# EAGLE design teensyShield1.6_alt (EAGLE 7.7.0)
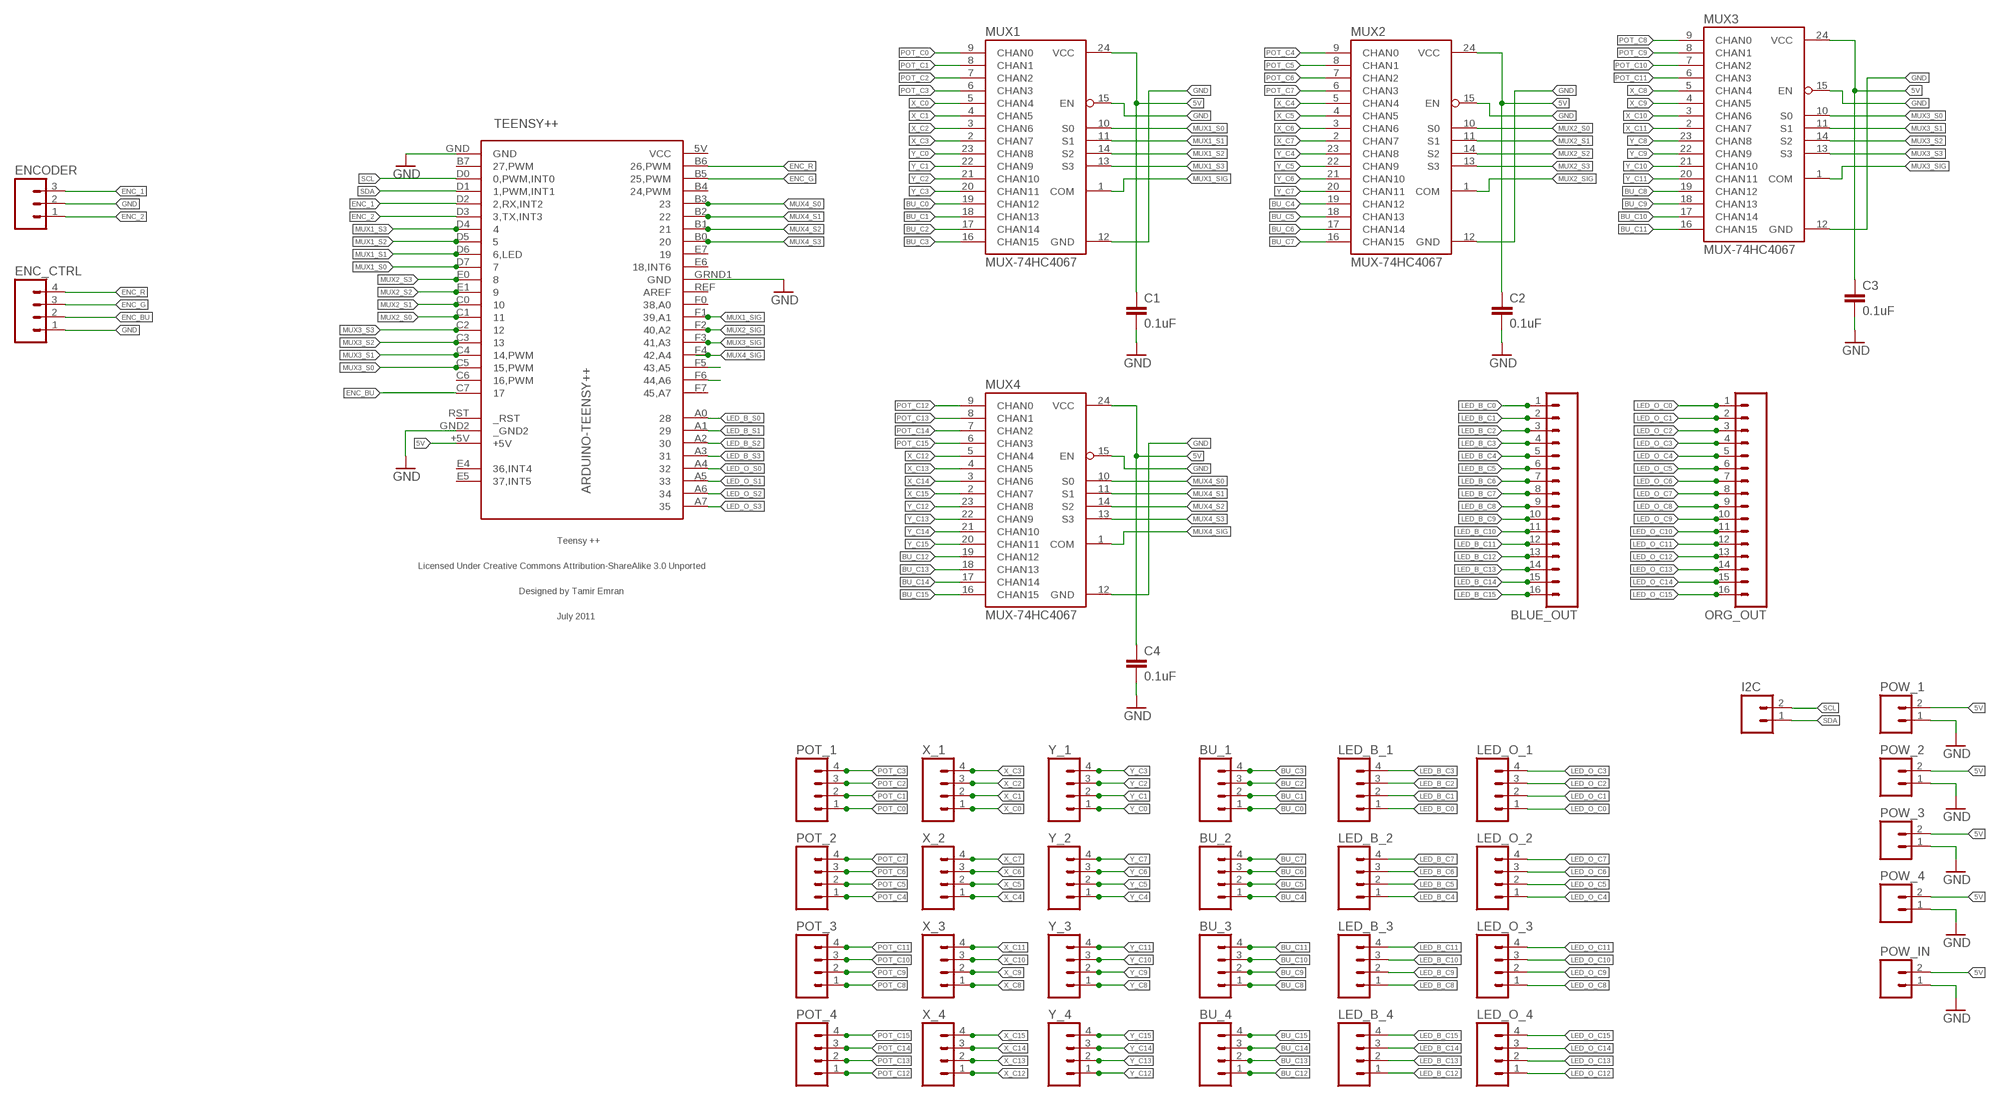
[diagram p0: schematic, sheet 1]

## Parts
BLUE_OUT  M161X16_NO_SILK  [1X16_NO_SILK]
BU_1  M04NO_SILK_ALL_ROUND  [1X04_NO_SILK_ALL_ROUND]
BU_2  M04NO_SILK_ALL_ROUND  [1X04_NO_SILK_ALL_ROUND]
BU_3  M04NO_SILK_ALL_ROUND  [1X04_NO_SILK_ALL_ROUND]
BU_4  M04NO_SILK_ALL_ROUND  [1X04_NO_SILK_ALL_ROUND]
C1  0.1uF  CAP0603  [0603]
C2  0.1uF  CAP0603  [0603]
C3  0.1uF  CAP0603  [0603]
C4  0.1uF  CAP0603  [0603]
ENC_CTRL  M041X04_NO_SILK  [1X04_NO_SILK]
ENCODER  M031X03_NO_SILK  [1X03_NO_SILK]
I2C  M02LOCK  [1X02_LOCK]
LED_B_1  M04NO_SILK_ALL_ROUND  [1X04_NO_SILK_ALL_ROUND]
LED_B_2  M04NO_SILK_ALL_ROUND  [1X04_NO_SILK_ALL_ROUND]
LED_B_3  M04NO_SILK_ALL_ROUND  [1X04_NO_SILK_ALL_ROUND]
LED_B_4  M04NO_SILK_ALL_ROUND  [1X04_NO_SILK_ALL_ROUND]
LED_O_1  M04NO_SILK_ALL_ROUND  [1X04_NO_SILK_ALL_ROUND]
LED_O_2  M04NO_SILK_ALL_ROUND  [1X04_NO_SILK_ALL_ROUND]
LED_O_3  M04NO_SILK_ALL_ROUND  [1X04_NO_SILK_ALL_ROUND]
LED_O_4  M04NO_SILK_ALL_ROUND  [1X04_NO_SILK_ALL_ROUND]
MUX1  MUX-74HC4067  MUX-74HC4067SMD  [SSOP24]
MUX2  MUX-74HC4067  MUX-74HC4067SMD  [SSOP24]
MUX3  MUX-74HC4067  MUX-74HC4067SMD  [SSOP24]
MUX4  MUX-74HC4067  MUX-74HC4067SMD  [SSOP24]
ORG_OUT  M161X16_NO_SILK  [1X16_NO_SILK]
POT_1  M04NO_SILK_ALL_ROUND  [1X04_NO_SILK_ALL_ROUND]
POT_2  M04NO_SILK_ALL_ROUND  [1X04_NO_SILK_ALL_ROUND]
POT_3  M04NO_SILK_ALL_ROUND  [1X04_NO_SILK_ALL_ROUND]
POT_4  M04NO_SILK_ALL_ROUND  [1X04_NO_SILK_ALL_ROUND]
POW_1  M02POLAR  [MOLEX-1X2]
POW_2  M02POLAR  [MOLEX-1X2]
POW_3  M02POLAR  [MOLEX-1X2]
POW_4  M02POLAR  [MOLEX-1X2]
POW_IN  M02POLAR  [MOLEX-1X2]
TEENSY++  ARDUINO-TEENSY++  [TEENSY++]
X_1  M04NO_SILK_ALL_ROUND  [1X04_NO_SILK_ALL_ROUND]
X_2  M04NO_SILK_ALL_ROUND  [1X04_NO_SILK_ALL_ROUND]
X_3  M04NO_SILK_ALL_ROUND  [1X04_NO_SILK_ALL_ROUND]
X_4  M04NO_SILK_ALL_ROUND  [1X04_NO_SILK_ALL_ROUND]
Y_1  M04NO_SILK_ALL_ROUND  [1X04_NO_SILK_ALL_ROUND]
Y_2  M04NO_SILK_ALL_ROUND  [1X04_NO_SILK_ALL_ROUND]
Y_3  M04NO_SILK_ALL_ROUND  [1X04_NO_SILK_ALL_ROUND]
Y_4  M04NO_SILK_ALL_ROUND  [1X04_NO_SILK_ALL_ROUND]

## Nets
5V: C1.1 C2.1 C3.1 C4.1 MUX1.24(VCC) MUX2.24(VCC) MUX3.24(VCC) MUX4.24(VCC) POW_1.2 POW_2.2 POW_3.2 POW_4.2 POW_IN.2
BU_C0: BU_1.1 MUX1.19(CHAN12)
BU_C1: BU_1.2 MUX1.18(CHAN13)
BU_C2: BU_1.3 MUX1.17(CHAN14)
BU_C3: BU_1.4 MUX1.16(CHAN15)
BU_C4: BU_2.1 MUX2.19(CHAN12)
BU_C5: BU_2.2 MUX2.18(CHAN13)
BU_C6: BU_2.3 MUX2.17(CHAN14)
BU_C7: BU_2.4 MUX2.16(CHAN15)
BU_C8: BU_3.1 MUX3.19(CHAN12)
BU_C9: BU_3.2 MUX3.18(CHAN13)
BU_C10: BU_3.3 MUX3.17(CHAN14)
BU_C11: BU_3.4 MUX3.16(CHAN15)
BU_C12: BU_4.1 MUX4.19(CHAN12)
BU_C13: BU_4.2 MUX4.18(CHAN13)
BU_C14: BU_4.3 MUX4.17(CHAN14)
BU_C15: BU_4.4 MUX4.16(CHAN15)
ENC_1: ENCODER.3 TEENSY++.D2(2,RX,INT2)
ENC_2: ENCODER.1 TEENSY++.D3(3,TX,INT3)
ENC_BU: ENC_CTRL.2 TEENSY++.C7
ENC_G: ENC_CTRL.3 TEENSY++.B5(25,PWM)
ENC_R: ENC_CTRL.4 TEENSY++.B6(26,PWM)
GND: C1.2 C2.2 C3.2 C4.2 ENC_CTRL.1 ENCODER.2 MUX1.12(GND) MUX1.15(EN) MUX2.12(GND) MUX2.15(EN) MUX3.12(GND) MUX3.15(EN) MUX4.12(GND) MUX4.15(EN) POW_1.1 POW_2.1 POW_3.1 POW_4.1 POW_IN.1 TEENSY++.GND TEENSY++.GND2(_GND2) TEENSY++.GRND1(GND)
LED_B_C0: BLUE_OUT.1 LED_B_1.1
LED_B_C1: BLUE_OUT.2 LED_B_1.2
LED_B_C2: BLUE_OUT.3 LED_B_1.3
LED_B_C3: BLUE_OUT.4 LED_B_1.4
LED_B_C4: BLUE_OUT.5 LED_B_2.1
LED_B_C5: BLUE_OUT.6 LED_B_2.2
LED_B_C6: BLUE_OUT.7 LED_B_2.3
LED_B_C7: BLUE_OUT.8 LED_B_2.4
LED_B_C8: BLUE_OUT.9 LED_B_3.1
LED_B_C9: BLUE_OUT.10 LED_B_3.2
LED_B_C10: BLUE_OUT.11 LED_B_3.3
LED_B_C11: BLUE_OUT.12 LED_B_3.4
LED_B_C12: BLUE_OUT.13 LED_B_4.1
LED_B_C13: BLUE_OUT.14 LED_B_4.2
LED_B_C14: BLUE_OUT.15 LED_B_4.3
LED_B_C15: BLUE_OUT.16 LED_B_4.4
LED_B_S0: TEENSY++.A0
LED_B_S1: TEENSY++.A1
LED_B_S2: TEENSY++.A2
LED_B_S3: TEENSY++.A3
LED_O_C0: LED_O_1.1 ORG_OUT.1
LED_O_C1: LED_O_1.2 ORG_OUT.2
LED_O_C2: LED_O_1.3 ORG_OUT.3
LED_O_C3: LED_O_1.4 ORG_OUT.4
LED_O_C4: LED_O_2.1 ORG_OUT.5
LED_O_C5: LED_O_2.2 ORG_OUT.6
LED_O_C6: LED_O_2.3 ORG_OUT.7
LED_O_C7: LED_O_2.4 ORG_OUT.8
LED_O_C8: LED_O_3.1 ORG_OUT.9
LED_O_C9: LED_O_3.2 ORG_OUT.10
LED_O_C10: LED_O_3.3 ORG_OUT.11
LED_O_C11: LED_O_3.4 ORG_OUT.12
LED_O_C12: LED_O_4.1 ORG_OUT.13
LED_O_C13: LED_O_4.2 ORG_OUT.14
LED_O_C14: LED_O_4.3 ORG_OUT.15
LED_O_C15: LED_O_4.4 ORG_OUT.16
LED_O_S0: TEENSY++.A4
LED_O_S1: TEENSY++.A5
LED_O_S2: TEENSY++.A6
LED_O_S3: TEENSY++.A7
MUX1_S0: MUX1.10(S0) TEENSY++.D7
MUX1_S1: MUX1.11(S1) TEENSY++.D6(6,LED)
MUX1_S2: MUX1.14(S2) TEENSY++.D5
MUX1_S3: MUX1.13(S3) TEENSY++.D4
MUX1_SIG: MUX1.1(COM)
MUX2_S0: MUX2.10(S0) TEENSY++.C1
MUX2_S1: MUX2.11(S1) TEENSY++.C0
MUX2_S2: MUX2.14(S2) TEENSY++.E1
MUX2_S3: MUX2.13(S3) TEENSY++.E0
MUX2_SIG: MUX2.1(COM)
MUX3_S0: MUX3.10(S0) TEENSY++.C5(15,PWM)
MUX3_S1: MUX3.11(S1) TEENSY++.C4(14,PWM)
MUX3_S2: MUX3.14(S2) TEENSY++.C3
MUX3_S3: MUX3.13(S3) TEENSY++.C2
MUX3_SIG: MUX3.1(COM) TEENSY++.F3(41,A3)
MUX4_S0: MUX4.10(S0) TEENSY++.B3
MUX4_S1: MUX4.11(S1) TEENSY++.B2
MUX4_S2: MUX4.14(S2) TEENSY++.B1
MUX4_S3: MUX4.13(S3) TEENSY++.B0
MUX4_SIG: MUX4.1(COM) TEENSY++.F4(42,A4)
N$1: TEENSY++.F2(40,A2)
N$2: TEENSY++.F1(39,A1)
N$3: TEENSY++.F5(43,A5)
N$4: TEENSY++.+5V
N$5: TEENSY++.F6(44,A6)
POT_C0: MUX1.9(CHAN0) POT_1.1
POT_C1: MUX1.8(CHAN1) POT_1.2
POT_C2: MUX1.7(CHAN2) POT_1.3
POT_C3: MUX1.6(CHAN3) POT_1.4
POT_C4: MUX2.9(CHAN0) POT_2.1
POT_C5: MUX2.8(CHAN1) POT_2.2
POT_C6: MUX2.7(CHAN2) POT_2.3
POT_C7: MUX2.6(CHAN3) POT_2.4
POT_C8: MUX3.9(CHAN0) POT_3.1
POT_C9: MUX3.8(CHAN1) POT_3.2
POT_C10: MUX3.7(CHAN2) POT_3.3
POT_C11: MUX3.6(CHAN3) POT_3.4
POT_C12: MUX4.9(CHAN0) POT_4.1
POT_C13: MUX4.8(CHAN1) POT_4.2
POT_C14: MUX4.7(CHAN2) POT_4.3
POT_C15: MUX4.6(CHAN3) POT_4.4
SCL: I2C.2 TEENSY++.D0(0,PWM,INT0)
SDA: I2C.1 TEENSY++.D1(1,PWM,INT1)
X_C0: MUX1.5(CHAN4) X_1.1
X_C1: MUX1.4(CHAN5) X_1.2
X_C2: MUX1.3(CHAN6) X_1.3
X_C3: MUX1.2(CHAN7) X_1.4
X_C4: MUX2.5(CHAN4) X_2.1
X_C5: MUX2.4(CHAN5) X_2.2
X_C6: MUX2.3(CHAN6) X_2.3
X_C7: MUX2.2(CHAN7) X_2.4
X_C8: MUX3.5(CHAN4) X_3.1
X_C9: MUX3.4(CHAN5) X_3.2
X_C10: MUX3.3(CHAN6) X_3.3
X_C11: MUX3.2(CHAN7) X_3.4
X_C12: MUX4.5(CHAN4) X_4.1
X_C13: MUX4.4(CHAN5) X_4.2
X_C14: MUX4.3(CHAN6) X_4.3
X_C15: MUX4.2(CHAN7) X_4.4
Y_C0: MUX1.23(CHAN8) Y_1.1
Y_C1: MUX1.22(CHAN9) Y_1.2
Y_C2: MUX1.21(CHAN10) Y_1.3
Y_C3: MUX1.20(CHAN11) Y_1.4
Y_C4: MUX2.23(CHAN8) Y_2.1
Y_C5: MUX2.22(CHAN9) Y_2.2
Y_C6: MUX2.21(CHAN10) Y_2.3
Y_C7: MUX2.20(CHAN11) Y_2.4
Y_C8: MUX3.23(CHAN8) Y_3.1
Y_C9: MUX3.22(CHAN9) Y_3.2
Y_C10: MUX3.21(CHAN10) Y_3.3
Y_C11: MUX3.20(CHAN11) Y_3.4
Y_C12: MUX4.23(CHAN8) Y_4.1
Y_C13: MUX4.22(CHAN9) Y_4.2
Y_C14: MUX4.21(CHAN10) Y_4.3
Y_C15: MUX4.20(CHAN11) Y_4.4
Unconnected: TEENSY++.B4(24,PWM) TEENSY++.B7(27,PWM) TEENSY++.C6(16,PWM) TEENSY++.E4(36,INT4) TEENSY++.E5(37,INT5) TEENSY++.E6(18,INT6) TEENSY++.E7 TEENSY++.F0(38,A0) TEENSY++.F7(45,A7) TEENSY++.REF(AREF) TEENSY++.RST(_RST)

## Power pins joined to a net without a drawn wire
VCC: TEENSY++.5V(VCC)

## Library data of the parts
BLUE_OUT ORG_OUT = SparkFun-Connectors:M16: 1x16 .1" header
BU_1-BU_4 ENC_CTRL LED_B_1-LED_B_4 LED_O_1-LED_O_4 POT_1-POT_4 X_1-X_4 Y_1-Y_4 = SparkFun-Connectors:M04: Header 4 Standard 4-pin 0.1" header. Use with straight break away headers (SKU : PRT-00116), right angle break away headers (PRT-00553), swiss pins (PRT-00743), machine pins (PRT-00117), and female headers (PRT-00115). Molex polarized connector foot print use with SKU : PRT-08231 with associated crimp pins and housings. 1MM SMD Version SKU: PRT-10208; PROD_ID: CONN-09696
C1-C4 = SparkFun:CAP: Capacitor Standard 0603 ceramic capacitor, and 0.1" leaded capacitor.
ENCODER = SparkFun-Connectors:M03: Header 3 Standard 3-pin 0.1" header. Use with straight break away headers (SKU : PRT-00116), right angle break away headers (PRT-00553), swiss pins (PRT-00743), machine pins (PRT-00117), and female headers (PRT-00115). Molex polarized connector foot print use with SKU : PRT-08232 with associated crimp pins and housings.
I2C POW_1-POW_4 POW_IN = SparkFun-Connectors:M02: Standard 2-pin 0.1" header. Use with - straight break away headers ( PRT-00116) - right angle break away headers (PRT-00553) - swiss pins (PRT-00743) - machine pins (PRT-00117) - female headers (PRT-00115) Molex polarized connector foot print use with: PRT-08233 with associated crimp pins and housings. 2.54_SCREWTERM for use with PRT-10571. 3.5mm Screw Terminal footprints for PRT-08084 5mm Screw Terminal footprints for use with PRT-08432
MUX1-MUX4 = SparkFun:MUX-74HC4067
TEENSY++ = teensypp:ARDUINO-TEENSY++: Teensy ++ Original Design by Mark Gross Modified Design by Tamir Emran Licensed Under Creative Commons Attribution-ShareAlike 3.0 Unported (CC BY-SA 3.0)

## Board
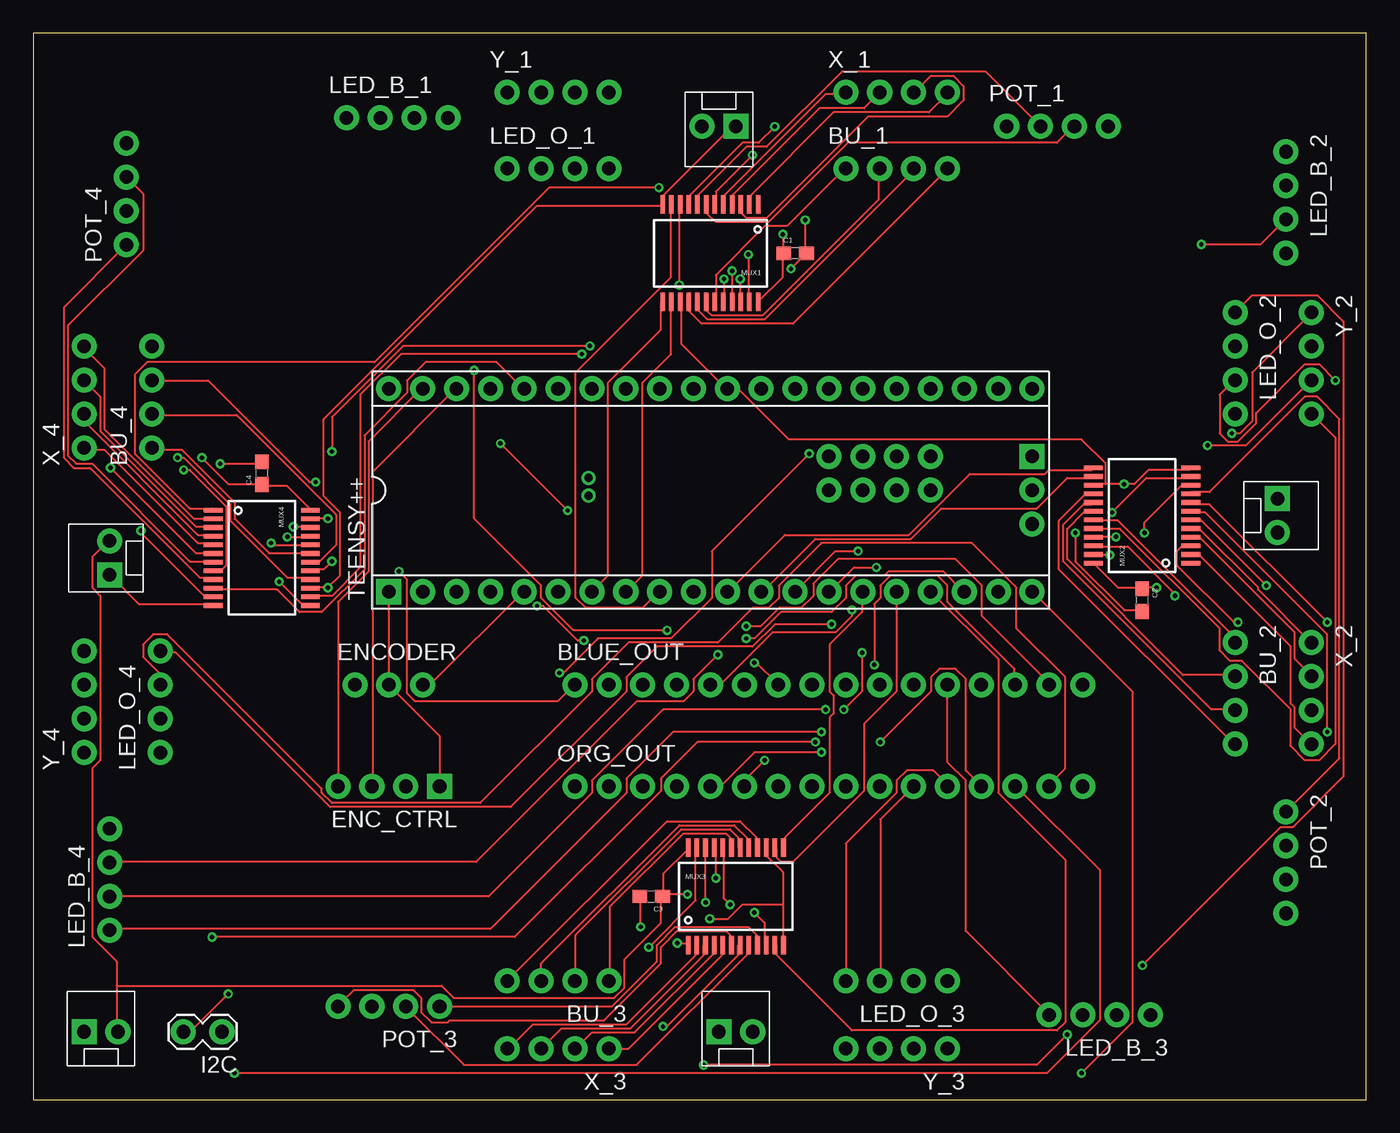
[diagram p1: board, top side]
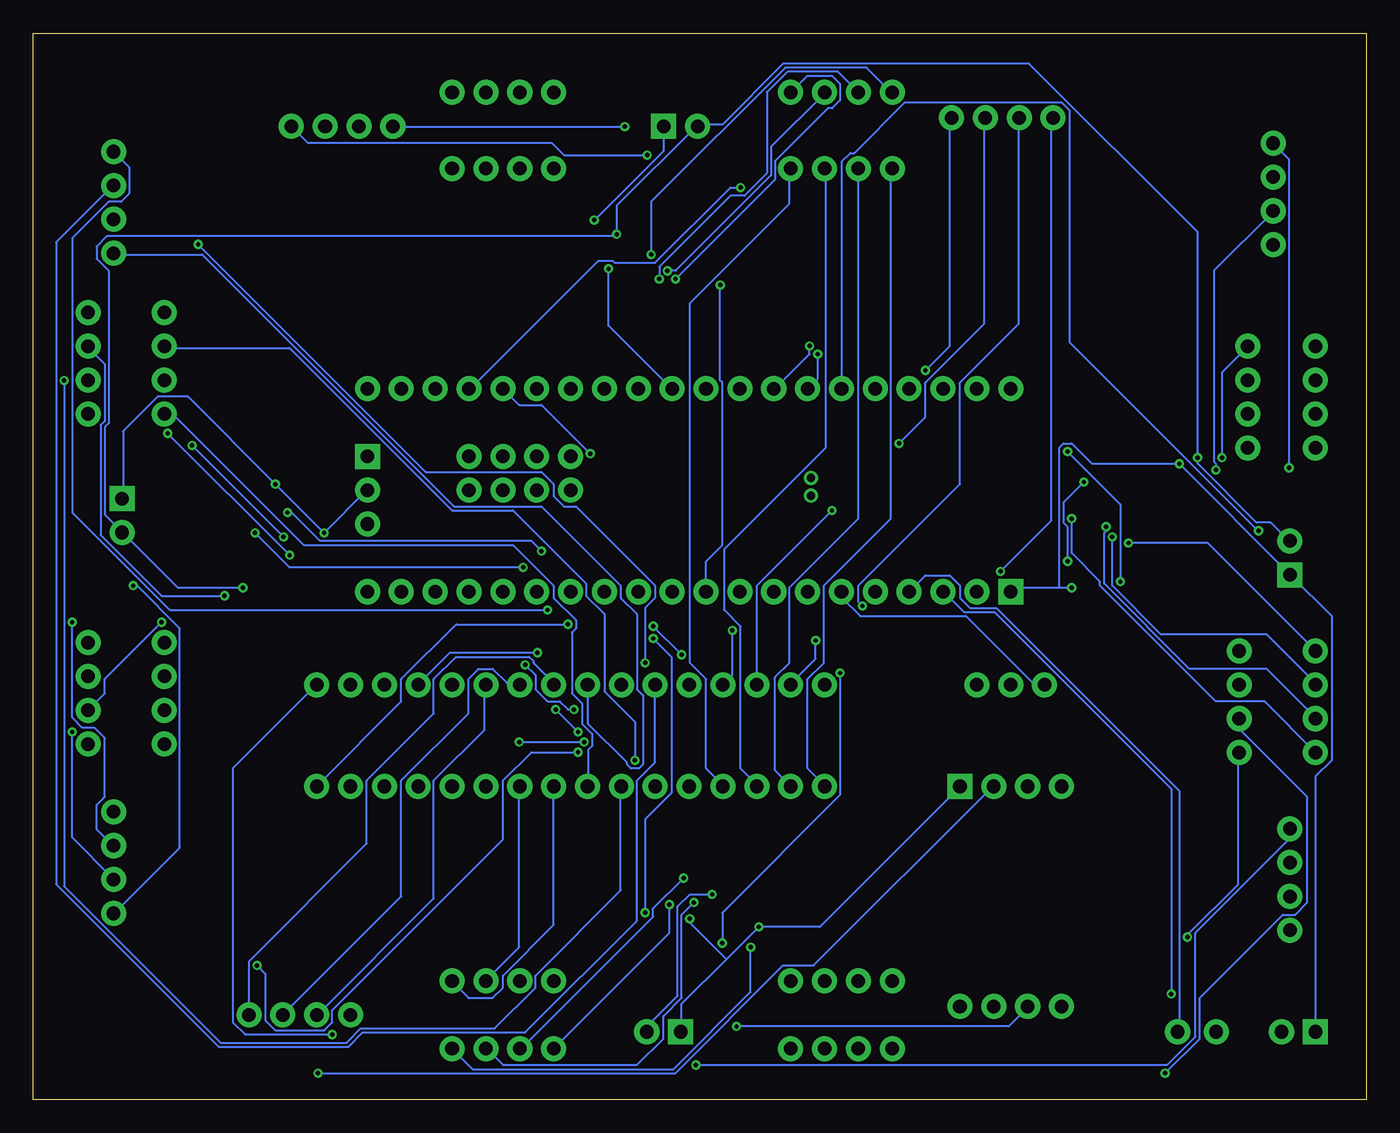
[diagram p2: board, bottom side, seen from below]

Size 100 x 80 mm. Coordinates in mm from the lower left corner, seen from the top.
Outline: 0,0 100,0 100,80 0,80 0,0
Copper layers (1*16): Top 0.0356mm / dielectric 1.5011mm / Bottom 0.0356mm
Design rules "oshpark-2layer *": minimum track width 6mil, minimum drill 13mil, track to track 6mil, track to pad 6mil, pad to pad 6mil, via to via 6mil, smd to smd 6mil, copper to edge 15mil, drill to drill 6mil, minimum pad ring 8mil, minimum via ring 7mil, stop-mask expansion 2.5mil, vias tented up to drill 0mil, thermal gap 10mil

### Footprints (pad centres in the part's own frame; a part is rotated, then mirrored left to right if it is on the bottom)
1X16_NO_SILK = drill 1.016 pad 1.88: 1 0,0; 2 2.54,0; 3 5.08,0; 4 7.62,0; 5 10.16,0; 6 12.7,0; 7 15.24,0; 8 17.78,0; 9 20.32,0; 10 22.86,0; 11 25.4,0; 12 27.94,0; 13 30.48,0; 14 33.02,0; 15 35.56,0; 16 38.1,0
1X04_NO_SILK_ALL_ROUND = drill 1.016 pad 1.88: 1 0,0; 2 2.54,0; 3 5.08,0; 4 7.62,0
0603 = smd 1.1 x 1: 1 -0.85,0; 2 0.85,0
1X04_NO_SILK = drill 1.016 pad 1.88 square: 1 0,0 | drill 1.016 pad 1.88: 2 2.54,0; 3 5.08,0; 4 7.62,0
1X03_NO_SILK = drill 1.016 pad 1.88: 1 0,0; 2 2.54,0; 3 5.08,0
1X02_LOCK = drill 1.016 pad 1.88: 1 -0.178,0; 2 2.718,0
SSOP24 = smd 0.348 x 1.397: 1 -3.575,-3.656; 2 -2.925,-3.656; 3 -2.275,-3.656; 4 -1.625,-3.656; 5 -0.975,-3.656; 6 -0.325,-3.656; 7 0.325,-3.656; 8 0.975,-3.656; 9 1.625,-3.656; 10 2.275,-3.656; 11 2.925,-3.656; 12 3.575,-3.656; 13 3.575,3.656; 14 2.925,3.656; 15 2.275,3.656; 16 1.625,3.656; 17 0.975,3.656; 18 0.325,3.656; 19 -0.325,3.656; 20 -0.975,3.656; 21 -1.625,3.656; 22 -2.275,3.656; 23 -2.925,3.656; 24 -3.575,3.656
MOLEX-1X2 = drill 1.016 pad 1.88 square: 1 0,0 | drill 1.016 pad 1.88: 2 2.54,0
TEENSY++ = drill 1.016 pad 1.88: 5V 24.13,-2.54; +5V -24.13,7.62; A0 8.89,0; A1 11.43,0; A2 13.97,0; A3 16.51,0; A4 8.89,2.54; A5 11.43,2.54; A6 13.97,2.54; A7 16.51,2.54; B0 -6.35,7.62; B1 -8.89,7.62; B2 -11.43,7.62; B3 -13.97,7.62; B4 -16.51,7.62; B5 -19.05,7.62; B6 -21.59,7.62; B7 -21.59,-7.62; C0 6.35,-7.62; C1 8.89,-7.62; C2 11.43,-7.62; C3 13.97,-7.62; C4 16.51,-7.62; C5 19.05,-7.62; C6 21.59,-7.62; C7 24.13,-7.62; D0 -19.05,-7.62; D1 -16.51,-7.62; D2 -13.97,-7.62; D3 -11.43,-7.62; D4 -8.89,-7.62; D5 -6.35,-7.62; D6 -3.81,-7.62; D7 -1.27,-7.62; E0 1.27,-7.62; E1 3.81,-7.62; E6 -1.27,7.62; E7 -3.81,7.62; F0 6.35,7.62; F1 8.89,7.62; F2 11.43,7.62; F3 13.97,7.62; F4 16.51,7.62; F5 19.05,7.62; F6 21.59,7.62; F7 24.13,7.62; GND2 24.13,0; GRND1 1.27,7.62; REF 3.81,7.62 | drill 0.635 pad 1.067: E4 -9.144,0.914; E5 -9.144,-0.406 | drill 1.016 pad 1.88 square: GND -24.13,-7.62; RST 24.13,2.54

### Placement (x,y rotation side)
BLUE_OUT  40.64,31.11 0 top
BU_1  60.96,69.85 0 top
BU_2  90.17,34.29 270 top
BU_3  43.18,8.89 180 top
BU_4  8.89,48.9 90 top
C1  57.15,63.5 0 top
C2  83.19,37.47 270 top
C3  46.35,15.24 180 top
C4  17.14,46.99 90 top
ENC_CTRL  30.48,23.5 180 top
ENCODER  24.13,31.11 0 top
I2C  13.97,5.08 180 top
LED_B_1  23.5,73.66 0 top
LED_B_2  93.98,71.12 270 top
LED_B_3  83.82,6.35 180 top
LED_B_4  5.71,12.7 90 top
LED_O_1  35.56,69.85 0 top
LED_O_2  90.17,59.05 270 top
LED_O_3  68.58,8.89 180 top
LED_O_4  9.53,26.04 90 top
MUX1  50.8,63.5 180 top
MUX2  83.19,43.81 90 top
MUX3  52.7,15.24 0 top
MUX4  17.14,40.64 270 top
ORG_OUT  40.64,23.5 0 top
POT_1  73.03,73.03 0 top
POT_2  93.98,21.59 270 top
POT_3  30.48,6.99 180 top
POT_4  6.99,64.14 90 top
POW_1  5.71,39.37 90 top
POW_2  52.7,73.03 180 top
POW_3  93.34,45.09 270 top
POW_4  51.44,5.08 0 top
POW_IN  3.81,5.08 0 top
TEENSY++  50.8,45.72 0 top
X_1  60.96,75.56 0 top
X_2  95.89,34.29 270 top
X_3  43.18,3.81 180 top
X_4  3.81,48.9 90 top
Y_1  35.56,75.56 0 top
Y_2  95.89,59.05 270 top
Y_3  68.58,3.81 180 top
Y_4  3.81,26.04 90 top

### Tracks (layer width: path | path; a pad name or v marks a point on that pad's centre or on a via)
5V  (via drill 0.33)
  Top 0.152: MUX2.24 79.55,40.23 81.38,38.41 83.06,38.41 C2.1 83.21,38.41 v84.28,38.41 | MUX1.24 54.41,59.89 56.24,61.72 56.24,63.4 C1.1 56.24,63.55 v56.24,64.92 | 47.24,15.39 47.24,16.92 49.07,18.75 MUX3.24 | 47.24,15.39 47.24,15.24 C3.1 | v49.07,15.39 47.24,15.39 | 47.24,15.39 C3.1 | MUX4.24 20.73,44.35 19.05,46.02 17.22,46.02 C4.1 17.07,46.18 14.63,46.18 v12.65,48.16 | 6.25,8.53 6.25,10.36 4.42,12.19 4.42,24.84 5.03,25.45 5.03,37.8 4.42,38.41 4.42,40.69 5.64,41.91 POW_1.2 | 6.25,8.53 6.25,5.18 POW_IN.2 | 6.25,8.53 30.63,8.53 31.55,7.62 43.59,7.62 44.35,8.38 44.35,10.52 47.09,13.26 47.09,15.24 C3.1
  Bottom 0.152: v84.28,38.41 89.15,38.41 93.27,42.52 POW_3.2 93.42,42.67 94.64,43.89 94.64,50.44 94.34,50.75 94.34,62.18 95.25,63.09 95.25,64.01 94.49,64.77 56.39,64.77 v56.24,64.92 56.24,67.06 50.29,73 POW_2.2 50.14,73.15 48.31,73.15 43.74,77.72 25.3,77.72 12.65,65.08 v12.65,48.16 12.65,47.7 8.23,43.28 7.16,43.28 5.79,41.91 POW_1.2 | v49.07,15.39 50.75,15.39 51.66,14.48 51.66,7.77 53.95,5.49 53.95,5.18 POW_4.2
BU_C0
  Top 0.152: MUX1.19 51.21,59.89 51.21,61.87 54.86,65.53 56.54,65.53 60.96,69.95 BU_1.1
BU_C1
  Top 0.152: MUX1.18 50.6,59.74 50.6,59.13 50.9,58.83 54.71,58.83 63.4,67.51 63.4,69.8 BU_1.2
BU_C2
  Top 0.152: MUX1.17 49.84,59.74 49.84,59.28 50.6,58.52 54.86,58.52 66.14,69.8 BU_1.3
BU_C3
  Top 0.152: MUX1.16 49.23,59.74 49.23,59.13 50.14,58.22 57,58.22 68.58,69.8 BU_1.4
BU_C4
  Top 0.152: MUX2.19 79.55,43.43 81.38,43.43 90.07,34.75 90.07,34.29 BU_2.1
BU_C5
  Top 0.152: MUX2.18 79.4,44.04 78.79,44.04 77.57,42.82 77.57,40.54 86.26,31.85 90.07,31.85 BU_2.2
BU_C6
  Top 0.152: MUX2.17 79.4,44.65 78.79,44.65 77.27,43.13 77.27,40.39 88.39,29.26 90.07,29.26 BU_2.3
BU_C7
  Top 0.152: MUX2.16 79.4,45.41 78.94,45.41 76.96,43.43 76.96,39.78 90.07,26.67 BU_2.4
BU_C8
  Top 0.152: MUX3.19 52.27,18.9 52.27,19.66 51.97,19.96 48.77,19.96 43.28,14.48 43.28,8.99 BU_3.1
BU_C9
  Top 0.152: MUX3.18 52.88,18.9 52.88,19.66 52.27,20.27 48.62,20.27 40.69,12.34 40.69,8.99 BU_3.2
BU_C10
  Top 0.152: BU_3.3 38.1,10.21 48.46,20.57 52.58,20.57 53.65,19.51 53.65,18.9 MUX3.17
BU_C11
  Top 0.152: BU_3.4 47.55,20.88 53.03,20.88 54.25,19.66 54.25,18.9 MUX3.16
BU_C12
  Top 0.152: MUX4.19 20.73,41 17.68,41 15.09,43.59 15.09,44.81 11.12,48.77 8.99,48.77 BU_4.1
BU_C13
  Top 0.152: MUX4.18 20.88,40.39 21.49,40.39 22.71,41.6 22.71,43.89 15.24,51.36 8.99,51.36 BU_4.2
BU_C14  (via drill 0.33)
  Top 0.152: v22.4,40.39 21.79,39.78 20.88,39.78 MUX4.17 | v21.18,46.33 20.73,46.33 13.11,53.95 8.99,53.95 BU_4.3
  Bottom 0.152: v22.4,40.39 22.4,42.98 22.71,43.28 22.71,44.81 v21.18,46.33
BU_C15  (via drill 0.33)
  Top 0.152: v10.82,48.16 11.28,48.16 14.78,44.65 14.78,43.43 19.05,39.17 20.73,39.17 MUX4.16
  Bottom 0.152: v10.82,48.16 10.82,54.56 8.99,56.39 BU_4.4
ENC_1
  Top 0.152: ENCODER.3 29.26,31.24 29.87,31.24 36.73,38.1 TEENSY++.D2
ENC_2
  Bottom 0.152: ENCODER.1 24.23,31.24 24.99,31.24 30.02,36.27 37.95,36.27 39.32,37.64 39.32,38.1 TEENSY++.D3
ENC_BU  (via drill 0.33)
  Top 0.152: v78.64,1.98 82.45,5.79 82.45,30.63 74.98,38.1 TEENSY++.C7
  Bottom 0.152: v78.64,1.98 51.82,1.98 43.74,10.06 41.45,10.06 28.04,23.47 ENC_CTRL.2
ENC_G
  Top 0.152: ENC_CTRL.3 25.45,23.62 25.45,47.09 31.7,53.34 TEENSY++.B5
ENC_R
  Top 0.152: ENC_CTRL.4 22.86,37.34 25.15,39.62 25.15,49.38 29.11,53.34 TEENSY++.B6
GND  (via drill 0.33)
  Top 0.152: v57.91,65.99 57.91,63.55 C1.2 57.91,63.4 v56.84,62.33 | POW_2.1 52.58,73.15 47.24,67.82 47.24,67.21 MUX1.12 47.09,67.06 37.8,67.06 21.79,51.05 21.79,45.26 23.01,44.04 23.01,39.32 v22.1,38.41 20.88,38.41 MUX4.15 | MUX1.15 48.62,59.74 48.62,56.69 51.97,53.34 TEENSY++.GRND1 52.88,53.34 56.69,49.53 78.64,49.53 80.47,47.7 80.47,46.18 | 80.47,46.18 v81.84,46.18 82.6,46.18 83.67,47.24 86.72,47.24 MUX2.12 | 80.47,46.18 79.55,46.18 MUX2.15 | v78.18,42.52 78.18,40.39 81.84,36.73 83.06,36.73 C2.2 | v14.02,47.7 17.07,47.7 C4.2 | MUX4.12 13.41,37.19 7.92,37.19 5.79,39.32 POW_1.1 | 56.24,14.63 56.24,17.07 55.02,18.29 55.02,18.75 MUX3.15 | 56.24,14.63 56.24,11.73 MUX3.12 | v45.57,12.95 45.57,15.24 C3.2 | 56.24,14.63 53.19,14.63 52.12,13.56 v50.75,13.56 | TEENSY++.GND ENCODER.2 26.67,31.09 30.48,27.28 ENC_CTRL.1
  Bottom 0.152: v57.91,65.99 52.73,71.17 52.73,73 POW_2.1 | TEENSY++.GND2 74.98,45.72 v78.18,42.52 v81.84,46.18 88.39,52.73 90.68,52.73 93.27,50.14 93.27,45.11 POW_3.1 | v56.84,62.33 56.84,58.06 52.12,53.34 TEENSY++.GRND1 | POW_IN.1 3.81,24.23 2.59,25.45 2.59,36.27 5.64,39.32 POW_1.1 5.79,39.47 v14.02,47.7 20.57,47.7 22.1,49.23 22.71,49.23 23.01,48.92 23.01,38.41 | 48.01,10.52 51.36,7.16 51.36,5.18 POW_4.1 | 48.01,10.52 v45.57,12.95 41,12.95 30.48,23.47 ENC_CTRL.1 | v50.75,13.56 50.75,13.26 48.01,10.52 | 23.01,38.41 26.36,38.41 TEENSY++.GND | 23.01,38.41 v22.1,38.41
LED_B_C0  (via drill 0.33)
  Top 0.152: v27.43,39.62 28.04,39.01 28.04,30.48 28.65,29.87 39.32,29.87 40.54,31.09 BLUE_OUT.1
  Bottom 0.152: v27.43,39.62 23.62,43.43 23.62,73.61 LED_B_1.1
LED_B_C1  (via drill 0.33)
  Top 0.152: v37.8,37.03 38.25,37.03 40.84,34.44 v41.3,34.44
  Bottom 0.152: v37.8,37.03 38.1,37.34 38.1,38.56 30.48,46.18 30.48,53.8 26.06,58.22 26.06,73.61 LED_B_1.2 | v41.3,34.44 41.3,33.07 43.13,31.24 BLUE_OUT.2
LED_B_C2  (via drill 0.33)
  Top 0.152: v40.08,44.2 v35.05,49.23
  Bottom 0.152: v35.05,49.23 33.07,51.21 33.07,53.8 28.65,58.22 28.65,73.61 LED_B_1.3 | v40.08,44.2 45.72,38.56 BLUE_OUT.3
LED_B_C3  (via drill 0.33)
  Top 0.152: v33.07,54.71 33.07,43.59 38.1,38.56 38.1,37.64 40.54,35.2 v47.55,35.2
  Bottom 0.152: v33.07,54.71 31.24,56.54 31.24,73.61 LED_B_1.4 | v47.55,35.2 47.55,31.85 48.16,31.24 BLUE_OUT.4
LED_B_C4  (via drill 0.33)
  Top 0.152: v61.42,36.73 61.42,36.27 60.2,35.05 55.47,35.05 51.66,31.24 50.9,31.24 BLUE_OUT.5
  Bottom 0.152: v61.42,36.73 89.76,36.73 97.08,44.04 97.08,64.62 94.34,67.36 93.42,67.36 92.81,67.97 92.81,69.95 LED_B_2.1
LED_B_C5
  Bottom 0.152: BLUE_OUT.6 53.34,25.3 54.71,23.93 54.71,13.41 63.09,5.03 75.29,5.03 76.35,3.96 86.11,3.96 98.3,16.15 98.3,64.31 94.03,68.58 LED_B_2.2
LED_B_C6  (via drill 0.33)
  Top 0.152: v54.1,32.77 54.25,32.77 55.78,31.24 BLUE_OUT.7 | v87.63,64.16 92.05,64.16 93.88,65.99 LED_B_2.3
  Bottom 0.152: v54.1,32.77 54.1,36.88 53.34,37.64 53.34,38.56 59.28,44.5 60.2,44.5 60.96,45.26 60.96,46.18 61.87,47.09 70.56,47.09 v87.63,64.16
LED_B_C7
  Bottom 0.152: BLUE_OUT.8 58.37,31.09 58.37,28.19 55.47,25.3 55.47,25.15 55.17,24.84 54.56,24.84 54.25,25.15 54.25,30.33 54.71,30.79 54.71,36.42 55.93,37.64 55.93,38.56 61.87,44.5 68.43,44.5 87.33,63.4 93.88,63.4 LED_B_2.4
LED_B_C8
  Bottom 0.152: LED_B_3.1 83.82,10.36 74.98,19.2 74.98,23.93 69.95,28.96 69.95,31.55 68.28,33.22 62.79,33.22 62.48,32.92 62.48,32.77 60.96,31.24 BLUE_OUT.9
LED_B_C9
  Bottom 0.152: LED_B_3.2 72.39,15.24 72.39,23.93 67.36,28.96 67.36,31.55 66.6,32.31 65.53,32.31 64.47,31.24 63.55,31.24 BLUE_OUT.10
LED_B_C10
  Bottom 0.152: BLUE_OUT.11 66.14,31.09 66.14,27.74 69.95,23.93 69.95,15.09 78.64,6.4 LED_B_3.3
LED_B_C11
  Top 0.152: BLUE_OUT.12 68.58,25.3 69.95,23.93 69.95,12.65 76.2,6.4 LED_B_3.4
LED_B_C12  (via drill 0.33)
  Top 0.152: v59.13,27.58 48.01,27.58 44.5,24.08 44.5,23.01 34.29,12.8 5.79,12.8 LED_B_4.1 | v60.81,29.26 62.18,30.63 v62.18,33.53
  Bottom 0.152: v60.81,29.26 v59.13,27.58 | v62.18,33.53 68.73,33.53 71.02,31.24 BLUE_OUT.13
LED_B_C13  (via drill 0.33)
  Top 0.152: LED_B_4.2 34.14,15.24 41.91,23.01 41.91,23.93 47.24,29.26 v59.44,29.26 | v63.09,32.61 63.09,37.19 63.55,37.64 63.55,38.56 64.31,39.32 67.82,39.32 68.58,38.56 68.58,37.34 73.61,32.31 73.61,31.24 BLUE_OUT.14
  Bottom 0.152: v59.44,29.26 59.89,29.26 60.5,29.87 61.42,29.87 62.33,30.79 62.33,31.85 v63.09,32.61
LED_B_C14  (via drill 0.33)
  Top 0.152: v51.36,33.38 49.53,31.55 49.53,30.63 48.77,29.87 45.26,29.87 33.22,17.83 5.79,17.83 LED_B_4.3 | v53.49,35.51 54.56,35.51 55.93,36.88 57.61,36.88 58.52,37.8 58.52,38.71 60.35,40.54 69.19,40.54 71.17,38.56 71.17,36.27 76.2,31.24 BLUE_OUT.15
  Bottom 0.152: v53.49,35.51 v51.36,33.38
LED_B_C15  (via drill 0.33)
  Top 0.152: v50.29,2.59 75.29,2.59 v77.57,4.88
  Bottom 0.152: v50.29,2.59 14.94,2.59 12.8,4.72 12.8,12.5 5.79,19.51 5.79,20.27 LED_B_4.4 | v77.57,4.88 84.12,4.88 85.04,5.79 85.04,24.84 78.79,31.09 BLUE_OUT.16
LED_O_C0
  Bottom 0.152: LED_O_1.1 35.66,69.8 35.66,43.59 40.69,38.56 40.69,32.77 41.91,31.55 41.91,24.84 40.69,23.62 ORG_OUT.1
LED_O_C1
  Bottom 0.152: LED_O_1.2 38.1,43.59 43.28,38.41 43.28,32.77 44.35,31.7 44.35,24.69 43.28,23.62 ORG_OUT.2
LED_O_C2
  Bottom 0.152: LED_O_1.3 40.54,69.8 40.54,48.92 48.16,41.3 48.16,36.73 46.94,35.51 46.94,24.84 45.72,23.62 ORG_OUT.3
LED_O_C3
  Bottom 0.152: LED_O_1.4 43.28,69.8 43.28,67.21 50.75,59.74 50.75,32.77 49.53,31.55 49.53,24.84 48.31,23.62 ORG_OUT.4
LED_O_C4  (via drill 0.33)
  Top 0.152: v59.13,26.06 54.1,26.06 51.66,23.62 50.9,23.62 ORG_OUT.5 | v83.21,10.06 93.57,20.42 94.49,20.42 98.3,24.23 98.3,58.37 96.32,60.35 91.44,60.35 90.22,59.13 LED_O_2.1
  Bottom 0.152: v59.13,26.06 62.64,26.06 64.77,23.93 64.77,19.51 77.57,6.71 77.57,5.79 78.18,5.18 81.84,5.18 82.6,5.94 82.6,9.45 v83.21,10.06
LED_O_C5  (via drill 0.33)
  Top 0.152: ORG_OUT.6 53.34,23.93 v54.86,25.45
  Bottom 0.152: v54.86,25.45 54.86,28.35 57.15,30.63 57.15,36.42 58.52,37.8 58.52,38.71 64.01,44.2 68.58,44.2 80.77,56.39 90.07,56.39 LED_O_2.2
LED_O_C6  (via drill 0.33)
  Top 0.152: v97.69,53.95 96.47,55.17 95.4,55.17 91.75,51.51 91.75,50.75 90.37,49.38 89.61,49.38 89,49.99 89,52.88 90.07,53.95 LED_O_2.3
  Bottom 0.152: v97.69,53.95 97.69,16 85.95,4.27 76.5,4.27 75.44,5.33 65.38,5.33 62.33,8.38 62.33,9.3 55.93,15.7 55.93,23.47 ORG_OUT.7
LED_O_C7
  Bottom 0.152: ORG_OUT.8 58.37,23.62 58.37,26.21 58.06,26.52 58.06,27.43 58.83,28.19 58.83,29.72 59.59,30.48 59.59,35.05 59.28,35.36 59.28,35.97 60.96,37.64 60.96,38.56 64.01,41.6 79.7,41.6 89.46,51.36 90.07,51.36 LED_O_2.4
LED_O_C8
  Bottom 0.152: ORG_OUT.9 60.96,13.11 64.77,9.3 64.77,8.38 65.53,7.62 67.36,7.62 68.58,8.84 LED_O_3.1
LED_O_C9
  Bottom 0.152: ORG_OUT.10 63.55,23.47 63.55,11.43 65.99,8.99 LED_O_3.2
LED_O_C10
  Top 0.152: LED_O_3.3 63.55,8.99 63.55,21.03 65.99,23.47 ORG_OUT.11
LED_O_C11
  Top 0.152: LED_O_3.4 60.96,19.2 64.77,23.01 64.77,23.93 65.53,24.69 67.51,24.69 68.58,23.62 ORG_OUT.12
LED_O_C12  (via drill 0.33)
  Top 0.152: v13.41,12.19 36.12,12.19 47.09,23.16 47.09,24.08 49.84,26.82 v58.67,26.82 | v63.55,26.82 67.36,30.63 67.36,31.7 67.97,32.31 69.19,32.31 69.95,31.55 69.95,24.69 71.02,23.62 ORG_OUT.13
  Bottom 0.152: v13.41,12.19 13.41,12.34 9.6,16.15 9.6,25.91 LED_O_4.1 | v63.55,26.82 v58.67,26.82
LED_O_C13  (via drill 0.33)
  Top 0.152: v15.09,1.98 76.05,1.98 80.01,5.94 80.01,17.22 73.76,23.47 ORG_OUT.14
  Bottom 0.152: v15.09,1.98 12.5,4.57 12.5,7.62 6.25,13.87 5.33,13.87 4.42,14.78 4.42,22.71 9.45,27.74 9.45,28.5 LED_O_4.2
LED_O_C14
  Top 0.152: LED_O_4.3 9.45,31.24 9.45,32 8.23,33.22 8.23,34.14 8.99,34.9 10.06,34.9 21.64,23.32 21.64,23.01 22.4,22.25 33.53,22.25 41.91,30.63 41.91,31.55 44.65,34.29 51.36,34.29 53.95,36.88 55.17,36.88 55.93,37.64 55.93,38.56 59.13,41.76 70.41,41.76 73.76,38.41 73.76,35.36 77.42,31.7 77.42,24.84 76.2,23.62 ORG_OUT.15
LED_O_C15  (via drill 0.33)
  Top 0.152: v59.89,35.66 55.63,35.66 53.95,33.98 46.79,33.98 44.5,31.7 44.5,30.63 35.81,21.95 22.25,21.95 10.67,33.53 9.6,33.53 LED_O_4.4
  Bottom 0.152: v59.89,35.66 68.28,35.66 72.39,31.55 72.39,29.87 78.64,23.62 ORG_OUT.16
MUX1_S0  (via drill 0.33)
  Top 0.152: v48.46,61.11 48.46,67.06 MUX1.10
  Bottom 0.152: v48.46,61.11 48.46,53.95 48.31,53.8 48.31,41.6 49.53,40.39 TEENSY++.D7
MUX1_S1
  Top 0.152: MUX1.11 47.85,67.06 47.85,61.72 40.69,54.56 40.69,37.64 41.45,36.88 45.72,36.88 46.94,38.1 TEENSY++.D6
MUX1_S2
  Top 0.152: MUX1.14 47.85,59.74 47.85,55.93 45.72,53.8 45.72,39.32 44.5,38.1 TEENSY++.D5
MUX1_S3
  Top 0.152: TEENSY++.D4 43.13,39.32 43.13,53.8 47.09,57.76 47.09,59.74 MUX1.13
MUX2_S0  (via drill 0.33)
  Top 0.152: v83.36,42.52 83.36,43.28 86.11,46.02 86.72,46.02 MUX2.10 | v63.25,39.93 61.57,39.93 59.74,38.1 TEENSY++.C1
  Bottom 0.152: v83.36,42.52 80.77,39.93 v63.25,39.93
MUX2_S1  (via drill 0.33)
  Top 0.152: v80.92,44.04 83.52,46.63 86.72,46.63 MUX2.11 | v61.87,41.15 60.2,41.15 TEENSY++.C0
  Bottom 0.152: v80.92,44.04 80.62,44.04 78.49,41.91 62.64,41.91 v61.87,41.15
MUX2_S2
  Top 0.152: MUX2.14 79.4,46.63 77.57,46.63 75.29,44.35 68.12,44.35 65.84,42.06 58.67,42.06 54.71,38.1 TEENSY++.E1
MUX2_S3
  Top 0.152: MUX2.13 79.4,47.24 76.2,47.24 75.89,46.94 70.26,46.94 65.68,42.37 56.39,42.37 52.12,38.1 TEENSY++.E0
MUX3_S0  (via drill 0.33)
  Top 0.152: v54.1,14.02 54.86,13.26 54.86,11.73 MUX3.10 | v53.49,34.59 54.1,34.59 56.08,36.58 59.89,36.58 60.96,37.64 60.96,38.56 61.72,39.32 63.86,39.32 64.16,39.62 68.28,39.62 69.8,38.1 TEENSY++.C5
  Bottom 0.152: v54.1,14.02 54.1,21.03 52.12,23.01 52.12,33.22 v53.49,34.59
MUX3_S1
  Top 0.152: MUX3.11 55.78,11.58 55.78,10.82 61.42,5.18 76.81,5.18 77.42,5.79 77.42,17.98 72.39,23.01 72.39,33.07 67.36,38.1 TEENSY++.C4
MUX3_S2
  Top 0.152: TEENSY++.C3 64.77,30.63 62.33,28.19 62.33,23.16 57,17.83 56.08,17.83 55.78,18.14 55.78,18.75 MUX3.14
MUX3_S3
  Top 0.152: MUX3.13 56.39,18.9 56.39,19.66 59.74,23.01 59.74,28.65 60.05,28.96 60.05,30.33 59.74,30.63 59.74,34.14 62.18,36.58 62.18,38.1 TEENSY++.C2
MUX3_SIG  (via drill 0.33)
  Top 0.152: v48.31,11.73 49.07,11.73 MUX3.1 | v39.47,32 39.78,32 42.37,34.59 47.85,34.59 50.9,37.64 50.9,41.15 v58.22,48.46
  Bottom 0.152: v48.31,11.73 48.31,14.02 39.47,22.86 v39.47,32 | v58.22,48.46 61.87,52.12 63.55,52.12 TEENSY++.F3
MUX4_S0
  Top 0.152: MUX4.10 13.56,38.25 18.29,38.25 19.96,36.58 21.64,36.58 24.84,39.78 24.84,49.84 28.04,53.03 28.04,53.95 29.41,55.32 34.75,55.32 36.73,53.34 TEENSY++.B3
MUX4_S1  (via drill 0.33)
  Top 0.152: v8.08,42.67 8.08,42.52 12.8,37.8 13.41,37.8 MUX4.11
  Bottom 0.152: v8.08,42.67 22.25,56.84 22.25,74.22 22.86,74.83 34.59,74.83 38.41,71.02 38.71,71.02 39.32,70.41 39.32,53.34 TEENSY++.B2
MUX4_S2  (via drill 0.33)
  Top 0.152: v41.15,55.93 27.58,55.93 24.54,52.88 24.54,39.93 22.4,37.8 20.88,37.8 MUX4.14
  Bottom 0.152: v41.15,55.93 41.15,54.1 TEENSY++.B1
MUX4_S3  (via drill 0.33)
  Top 0.152: v18.44,38.86 20.12,37.19 20.73,37.19 MUX4.13 | v22.4,48.62 22.4,51.21 27.74,56.54 v41.76,56.54
  Bottom 0.152: v18.44,38.86 18.44,44.65 v22.4,48.62 | v41.76,56.54 41.76,55.93 44.35,53.34 TEENSY++.B0
MUX4_SIG  (via drill 0.33)
  Top 0.152: v46.94,68.43 38.71,68.43 25.6,55.32 8.53,55.32 7.62,54.41 7.62,48.46 11.73,44.35 13.41,44.35 MUX4.1
  Bottom 0.152: v46.94,68.43 47.7,68.43 53.34,62.79 56.39,62.79 56.54,62.94 57.61,62.94 67.21,53.34 TEENSY++.F4
POT_C0  (via drill 0.33)
  Top 0.152: v55.63,73 54.41,71.78 53.19,71.78 49.23,67.82 49.23,67.21 MUX1.9
  Bottom 0.152: v55.63,73 73,73 POT_1.1
POT_C1
  Top 0.152: POT_1.2 71.48,77.11 60.66,77.11 55.02,71.48 53.49,71.48 49.84,67.82 49.84,67.21 MUX1.8
POT_C2
  Top 0.152: MUX1.7 50.6,67.06 50.6,66.45 51.21,65.84 55.17,65.84 61.11,71.78 76.81,71.78 78.03,73 POT_1.3
POT_C3  (via drill 0.33)
  Top 0.152: v53.95,70.87 51.21,68.12 51.21,67.21 MUX1.6
  Bottom 0.152: v53.95,70.87 60.2,70.87 61.11,71.78 79.4,71.78 POT_1.4
POT_C4
  Top 0.152: POT_2.1 97.99,25.6 97.99,51.05 96.32,52.73 95.4,52.73 88.24,45.57 86.87,45.57 MUX2.9
POT_C5  (via drill 0.33)
  Top 0.152: v97.08,35.81 88.24,44.65 86.87,44.65 MUX2.8
  Bottom 0.152: v97.08,35.81 97.08,28.65 96.32,27.89 95.4,27.89 94.64,27.13 94.64,22.71 95.25,22.1 95.25,20.27 94.03,19.05 POT_2.2
POT_C6  (via drill 0.33)
  Top 0.152: v97.08,27.58 97.08,34.9 87.94,44.04 86.87,44.04 MUX2.7
  Bottom 0.152: v97.08,27.58 97.08,19.66 94.03,16.61 POT_2.3
POT_C7  (via drill 0.33)
  Top 0.152: v92.51,38.56 87.63,43.43 86.87,43.43 MUX2.6
  Bottom 0.152: v92.51,38.56 92.2,38.56 89,35.36 89,18.9 93.88,14.02 POT_2.4
POT_C8
  Top 0.152: MUX3.9 54.25,11.73 54.25,12.34 53.65,12.95 48.16,12.95 46.79,11.58 46.79,10.36 43.43,7.01 30.48,7.01 POT_3.1
POT_C9
  Top 0.152: MUX3.8 53.65,11.58 53.65,10.97 45.26,2.59 32.31,2.59 28.04,6.86 POT_3.2
POT_C10  (via drill 0.33)
  Top 0.152: v47.24,5.49 47.55,5.49 52.88,10.82 52.88,11.58 MUX3.7
  Bottom 0.152: v47.24,5.49 26.82,5.49 25.45,6.86 POT_3.3
POT_C11
  Top 0.152: MUX3.6 52.27,11.73 52.27,12.34 51.97,12.65 48.31,12.65 47.09,11.43 47.09,10.21 42.82,5.94 31.24,5.94 31.09,5.79 29.87,5.79 29.11,6.55 29.11,7.62 28.5,8.23 24.08,8.23 22.86,7.01 POT_3.4
POT_C12
  Top 0.152: POT_4.1 2.29,59.44 2.29,48.16 3.05,47.4 4.27,47.4 12.5,39.17 13.41,39.17 MUX4.9
POT_C13  (via drill 0.33)
  Top 0.152: v11.28,47.24 11.73,47.24 14.48,44.5 14.48,40.08 14.17,39.78 13.56,39.78 MUX4.8
  Bottom 0.152: v11.28,47.24 11.28,47.7 11.43,47.85 11.43,62.18 7.01,66.6 POT_4.2
POT_C14
  Top 0.152: POT_4.3 8.23,67.97 8.23,63.7 2.59,58.06 2.59,48.31 3.2,47.7 4.42,47.7 11.73,40.39 13.41,40.39 MUX4.7
POT_C15  (via drill 0.33)
  Top 0.152: v5.79,47.4 12.19,41 13.41,41 MUX4.6
  Bottom 0.152: v5.79,47.4 5.79,70.56 POT_4.4
SCL  (via drill 0.33)
  Top 0.152: v14.63,7.92 11.89,5.18 11.28,5.18 I2C.2
  Bottom 0.152: v14.63,7.92 14.63,23.32 27.89,36.58 30.18,36.58 31.7,38.1 TEENSY++.D0
SDA
  Bottom 0.152: TEENSY++.D1 33.07,39.32 31.24,39.32 30.48,38.56 30.48,37.64 29.72,36.88 27.74,36.88 14.02,23.16 14.02,5.18 I2C.1
X_C0
  Top 0.152: MUX1.5 51.82,67.21 51.82,67.82 59.44,75.44 60.96,75.44 X_1.1
X_C1
  Top 0.152: MUX1.4 52.43,67.21 52.43,67.82 58.98,74.37 62.33,74.37 63.4,75.44 X_1.2
X_C2
  Top 0.152: MUX1.3 53.19,67.06 53.19,66.45 53.49,66.14 55.02,66.14 62.64,73.76 68.58,73.76 69.8,74.98 69.8,76.05 69.04,76.81 67.36,76.81 66.14,75.59 X_1.3
X_C3
  Top 0.152: MUX1.2 53.8,67.21 53.8,67.82 60.05,74.07 67.21,74.07 68.58,75.44 X_1.4
X_C4
  Top 0.152: MUX2.5 86.87,42.82 87.48,42.82 91.9,38.41 91.9,38.25 95.86,34.29 X_2.1
X_C5
  Top 0.152: MUX2.4 86.87,42.06 87.63,42.06 94.64,35.05 94.64,33.07 95.86,31.85 X_2.2
X_C6  (via drill 0.33)
  Top 0.152: v90.37,35.81 90.07,35.81 85.8,40.08 85.8,41.15 86.11,41.45 86.72,41.45 MUX2.3
  Bottom 0.152: v90.37,35.81 94.64,31.55 94.64,30.48 95.86,29.26 X_2.3
X_C7
  Top 0.152: MUX2.2 86.87,40.84 87.48,40.84 94.34,33.98 94.34,29.72 94.64,29.41 94.64,27.89 95.86,26.67 X_2.4
X_C8
  Top 0.152: X_3.1 44.65,3.81 51.66,10.82 51.66,11.58 MUX3.5
X_C9
  Top 0.152: MUX3.4 51.05,11.58 51.05,10.97 45.11,5.03 41.91,5.03 40.69,3.81 X_3.2
X_C10
  Top 0.152: X_3.3 39.62,5.33 44.81,5.33 50.29,10.82 50.29,11.58 MUX3.3
X_C11
  Top 0.152: MUX3.2 49.68,11.58 49.68,10.82 44.5,5.64 37.49,5.64 35.66,3.81 X_3.4
X_C12
  Top 0.152: MUX4.5 13.41,41.76 12.34,41.76 5.33,48.77 3.81,48.77 X_4.1
X_C13
  Top 0.152: X_4.2 3.81,50.9 12.34,42.37 13.41,42.37 MUX4.4
X_C14
  Top 0.152: MUX4.3 13.41,42.98 12.19,42.98 5.03,50.14 5.03,52.73 3.81,53.95 X_4.3
X_C15
  Top 0.152: MUX4.2 13.41,43.59 12.04,43.59 5.33,50.29 5.33,54.86 3.81,56.39 X_4.4
Y_C0  (via drill 0.33)
  Top 0.152: v53.65,63.4 53.65,59.89 MUX1.23
  Bottom 0.152: v53.65,63.4 53.65,67.36 43.59,77.42 37.49,77.42 35.66,75.59 Y_1.1
Y_C1  (via drill 0.33)
  Top 0.152: v53.03,61.57 53.03,59.89 MUX1.22
  Bottom 0.152: v53.03,61.57 53.03,62.48 47.7,67.82 46.63,67.82 44.96,69.49 44.96,75.59 43.43,77.11 39.62,77.11 38.1,75.59 Y_1.2
Y_C2  (via drill 0.33)
  Top 0.152: v52.43,62.18 52.43,59.89 MUX1.21
  Bottom 0.152: v52.43,62.18 51.82,62.18 44.65,69.34 44.65,71.48 40.69,75.44 Y_1.3
Y_C3  (via drill 0.33)
  Top 0.152: v51.82,61.57 51.82,59.89 MUX1.20
  Bottom 0.152: v51.82,61.57 44.35,69.04 44.35,70.41 40.39,74.37 40.08,74.37 39.47,74.98 39.47,76.2 40.08,76.81 41.91,76.81 43.13,75.59 Y_1.4
Y_C4  (via drill 0.33)
  Top 0.152: v80.77,40.84 79.55,40.84 MUX2.23 | v89.92,49.99 90.53,49.99 91.44,50.9 91.44,54.56 95.86,58.98 Y_2.1
  Bottom 0.152: v89.92,49.99 v80.77,40.84
Y_C5  (via drill 0.33)
  Top 0.152: v85.65,37.8 85.65,37.95 82.14,41.45 79.55,41.45 MUX2.22
  Bottom 0.152: v85.65,37.8 90.37,37.8 94.94,42.37 94.94,50.6 94.64,50.9 94.64,55.17 95.86,56.39 Y_2.2
Y_C6  (via drill 0.33)
  Top 0.152: v81.23,42.22 79.55,42.22 MUX2.21 | v88.09,49.07 90.98,49.07 Y_2.3
  Bottom 0.152: v88.09,49.07 v81.23,42.22
Y_C7
  Top 0.152: MUX2.20 79.55,42.82 81.53,42.82 89,35.36 89,33.68 89.76,32.92 90.68,32.92 94.34,29.26 94.34,26.52 95.4,25.45 96.47,25.45 97.69,26.67 97.69,49.68 96.01,51.36 Y_2.4
Y_C8  (via drill 0.33)
  Top 0.152: v46.18,11.43 49.68,14.94 49.68,18.75 MUX3.23
  Bottom 0.152: v46.18,11.43 46.18,8.08 51.97,2.29 67.06,2.29 Y_3.1
Y_C9  (via drill 0.33)
  Top 0.152: v50.44,14.78 50.44,18.75 MUX3.22
  Bottom 0.152: v50.44,14.78 51.36,13.87 51.36,7.62 52.73,6.25 52.73,4.57 54.71,2.59 64.77,2.59 65.99,3.81 Y_3.2
Y_C10  (via drill 0.33)
  Top 0.152: v51.21,16.61 51.21,18.75 MUX3.21
  Bottom 0.152: v51.21,16.61 53.49,14.33 53.49,13.72 63.4,3.81 Y_3.3
Y_C11  (via drill 0.33)
  Top 0.152: v52.27,14.63 51.82,15.09 51.82,18.75 MUX3.20
  Bottom 0.152: v52.27,14.63 52.27,12.5 Y_3.4
Y_C12  (via drill 0.33)
  Top 0.152: v22.1,43.59 20.88,43.59 MUX4.23
  Bottom 0.152: v22.1,43.59 22.1,41 19.96,38.86 19.96,38.56 11.28,29.87 7.62,29.87 3.81,26.06 Y_4.1
Y_C13  (via drill 0.33)
  Top 0.152: v19.51,42.98 20.73,42.98 MUX4.22
  Bottom 0.152: v19.51,42.98 19.51,42.67 19.66,42.52 19.66,38.71 13.26,32.31 7.47,32.31 3.81,28.65 Y_4.2
Y_C14  (via drill 0.33)
  Top 0.152: v19.05,42.22 20.73,42.22 MUX4.21
  Bottom 0.152: v19.05,42.22 19.05,38.56 15.39,34.9 7.47,34.9 3.81,31.24 Y_4.3
Y_C15  (via drill 0.33)
  Top 0.152: v17.83,41.76 17.98,41.6 20.73,41.6 MUX4.20
  Bottom 0.152: v17.83,41.76 11.89,41.76 3.81,33.68 Y_4.4